# Altium schematic sheet DS18B20_继电器.SchDoc
size A4; PageSetup: Record=PageOptions|CenterHorizontal=True|CenterVertical=True|PrintScale=0.97|XCorrection=1.00|YCorrection=1.00|PrintKind=0|BorderSize=5000000|LeftOffset=0|BottomOffset=0|Orientation=2|PaperLength=1000|PaperWidth=1000|Scale=100|PaperSource=7|PrintQuality=-4|MediaType=1|DitherType=10|PaperKind=A4|PrintScaleMode=1
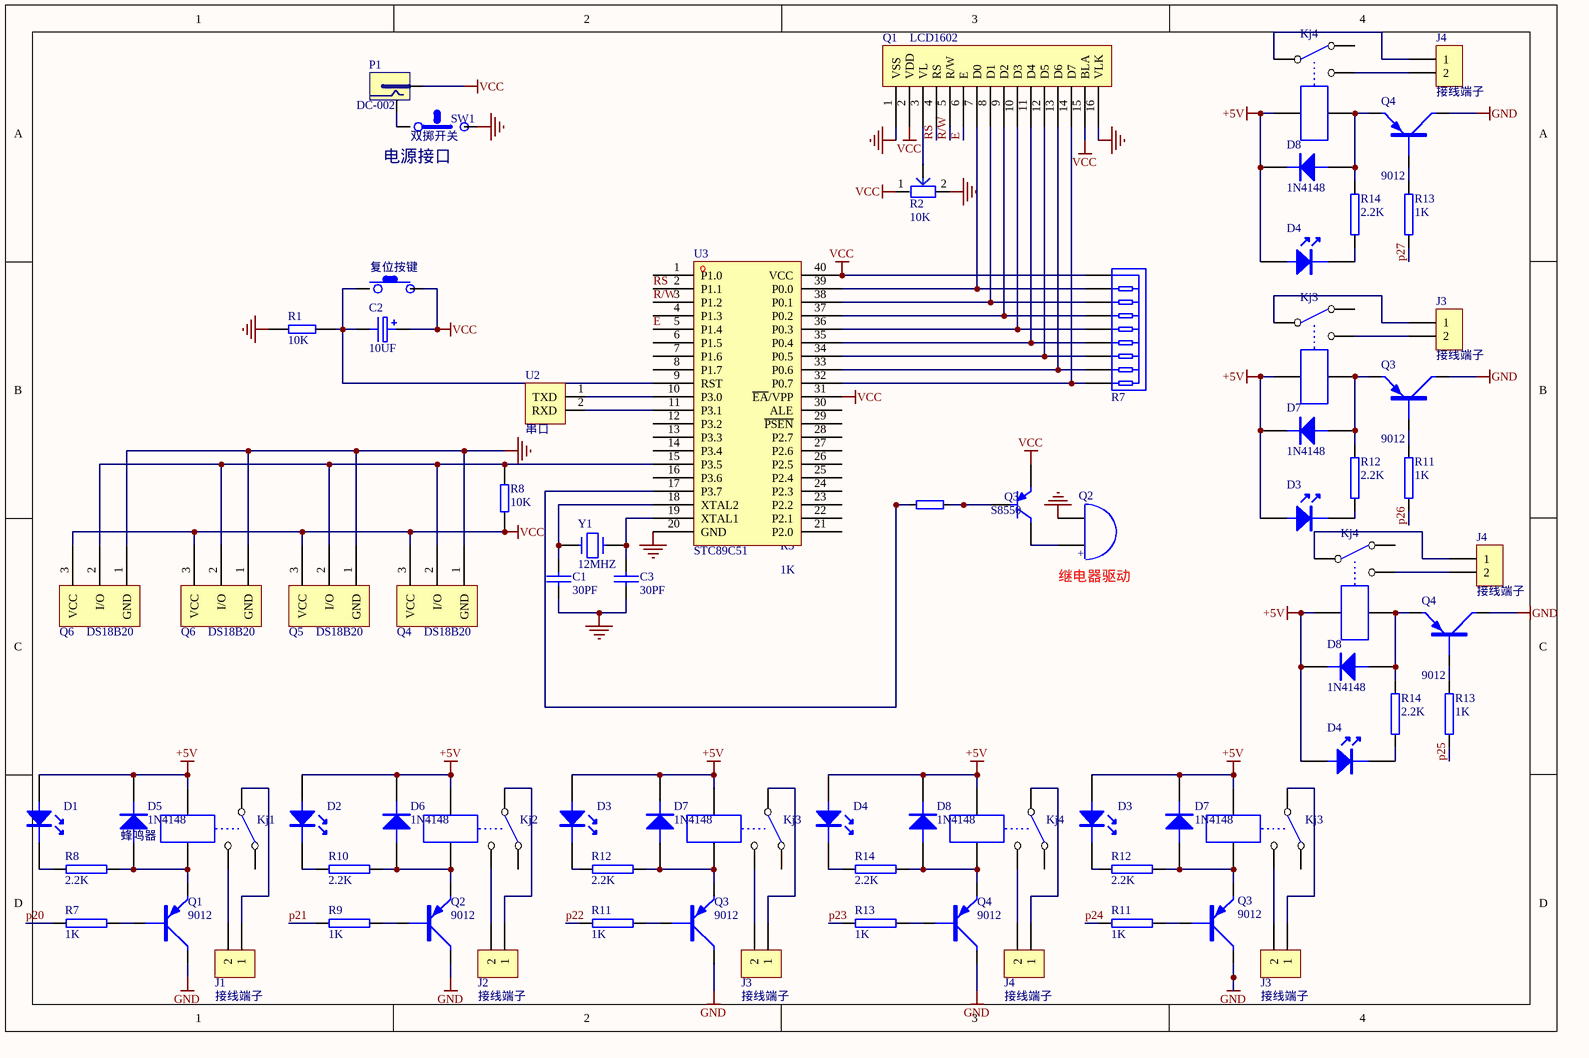
[diagram p0: DS18B20_继电器.SchDoc]

## Parts
(Parts that share a designator on the sheet are numbered #1, #2 ... from top to bottom, then left to right.)
C1  30PF  [R38]
C2  10UF  [CD4]
C3  30PF  [R38]
D1  (no value)  [LED5]
D2  (no value)  [LED5]
D3#1  (no value)  [LED5]
D3#2  (no value)  [LED5]
D3#3  (no value)  [LED5]
D4#1  (no value)  [LED5]
D4#2  (no value)  [LED5]
D4#3  (no value)  [LED5]
D5  1N4148  [4148]
D6  1N4148  [4148]
D7#1  1N4148  [4148]
D7#2  1N4148  [4148]
D7#3  1N4148  [4148]
D8#1  1N4148  [4148]
D8#2  1N4148  [4148]
D8#3  1N4148  [4148]
J1  接线端子
J2  接线端子
J3#1  接线端子
J3#2  接线端子
J3#3  接线端子
J4#1  接线端子
J4#2  接线端子
J4#3  接线端子
KEY1  复位按键  [SW]
Kj1  (no value)  [21F]
Kj2  (no value)  [21F]
Kj3#1  (no value)  [21F]
Kj3#2  (no value)  [21F]
Kj3#3  (no value)  [21F]
Kj4#1  (no value)  [21F]
Kj4#2  (no value)  [21F]
Kj4#3  (no value)  [21F]
P1  DC-002  [DC-002]
Q1#1  LCD1602  [HDR16]
Q1#2  9012  [9014]
Q2#1  蜂鸣器  [蜂鸣器]
Q2#2  9012  [9014]
Q3#1  9012  [9014]
Q3#2  S8550  [三极管]
Q3#3  9012  [9014]
Q3#4  9012  [9014]
Q4#1  9012  [9014]
Q4#2  DS18B20  [HDR3]
Q4#3  9012  [9014]
Q4#4  9012  [9014]
Q5  DS18B20  [HDR3]
Q6#1  DS18B20  [HDR3]
Q6#2  DS18B20  [HDR3]
R1  10K  [AXIAL-0.3]
R2  10K  [Res-JT]
R3  1K  [AXIAL-0.3]
R7#1  10k  [R*9]  (value not drawn)
R7#2  1K  [1/4W]
R8#1  10K  [AXIAL-0.3]
R8#2  2.2K  [1/4W]
R9  1K  [1/4W]
R10  2.2K  [1/4W]
R11#1  1K  [1/4W]
R11#2  1K  [1/4W]
R11#3  1K  [1/4W]
R12#1  2.2K  [1/4W]
R12#2  2.2K  [1/4W]
R12#3  2.2K  [1/4W]
R13#1  1K  [1/4W]
R13#2  1K  [1/4W]
R13#3  1K  [1/4W]
R14#1  2.2K  [1/4W]
R14#2  2.2K  [1/4W]
R14#3  2.2K  [1/4W]
SW1  双掷开关  [双掷开关]
U2  串口  [HDR2]
U3  STC89C51  [STC89C52]
Y1  12MHZ  [XTAL]

## Nets
+5V: D1.A D2.A D3#1.A D3#2.A D3#3.A D4#1.A D4#2.A D4#3.A D5.2(K) D6.2(K) D7#1.2(K) D7#2.2(K) D7#3.2(K) D8#1.2(K) D8#2.2(K) D8#3.2(K) Kj1.4 Kj2.4 Kj3#1.4 Kj3#2.4 Kj3#3.4 Kj4#1.4 Kj4#2.4 Kj4#3.4
GND: C1.2 C3.1 Q1#1.1(VSS) Q1#1.16(VLK) Q1#2.3(C) Q2#1.2 Q2#2.3(C) Q3#1.3(C) Q3#3.3(C) Q3#4.3(C) Q4#1.3(C) Q4#2.1(GND) Q4#3.3(C) Q4#4.3(C) Q5.1(GND) Q6#1.1(GND) Q6#2.1(GND) R1.1 R2.2 SW1.2 U3.20(GND)
VCC: C2.1 KEY1.2 P1.1 Q1#1.2(VDD) Q1#1.15(BLA) Q3#2.1(E) Q4#2.3(VCC) Q5.3(VCC) Q6#1.3(VCC) Q6#2.3(VCC) R2.1 R7#1.1 R8#1.2 U3.31(~{EA}/VPP) U3.40(VCC)
E: Q1#1.6(E) U3.5(P1.4)
p20: R7#2.1
p21: R9.1
p22: R11#2.1
p23: R13#3.1
p24: R11#3.1
p25: R13#2.1
p26: R11#1.1
p27: R13#1.1
R/W: Q1#1.5(R/W) U3.3(P1.2)
RS: Q1#1.4(RS) U3.2(P1.1)
NetC1_1: C1.1 U3.18(XTAL2) Y1.2
NetC2_2: C2.2(E) KEY1.1 R1.2 U3.9(RST)
NetC3_2: C3.2 U3.19(XTAL1) Y1.1
NetD1_K: D1.K R8#2.1
NetD2_K: D2.K R10.1
NetD3#1_K: D3#1.K R12#1.1
NetD3#2_K: D3#2.K R12#2.1
NetD3#3_K: D3#3.K R12#3.1
NetD4#1_K: D4#1.K R14#1.1
NetD4#2_K: D4#2.K R14#2.1
NetD4#3_K: D4#3.K R14#3.1
NetD5_1: D5.1(A) Kj1.5 Q1#2.2(E) R8#2.2
NetD6_1: D6.1(A) Kj2.5 Q2#2.2(E) R10.2
NetD7#1_1: D7#1.1(A) Kj3#1.5 Q3#1.2(E) R12#1.2
NetD7#2_1: D7#2.1(A) Kj3#2.5 Q3#3.2(E) R12#2.2
NetD7#3_1: D7#3.1(A) Kj3#3.5 Q3#4.2(E) R12#3.2
NetD8#1_1: D8#1.1(A) Kj4#1.5 Q4#1.2(E) R14#1.2
NetD8#2_1: D8#2.1(A) Kj4#2.5 Q4#3.2(E) R14#2.2
NetD8#3_1: D8#3.1(A) Kj4#3.5 Q4#4.2(E) R14#3.2
NetJ1_1: J1.1 Kj1.1
NetJ1_2: J1.2 Kj1.3
NetJ2_1: J2.1 Kj2.1
NetJ2_2: J2.2 Kj2.3
NetJ3#1_1: J3#1.1 Kj3#1.1
NetJ3#1_2: J3#1.2 Kj3#1.3
NetJ3#2_1: J3#2.1 Kj3#2.1
NetJ3#2_2: J3#2.2 Kj3#2.3
NetJ3#3_1: J3#3.1 Kj3#3.1
NetJ3#3_2: J3#3.2 Kj3#3.3
NetJ4#1_1: J4#1.1 Kj4#1.1
NetJ4#1_2: J4#1.2 Kj4#1.3
NetJ4#2_1: J4#2.1 Kj4#2.1
NetJ4#2_2: J4#2.2 Kj4#2.3
NetJ4#3_1: J4#3.1 Kj4#3.1
NetJ4#3_2: J4#3.2 Kj4#3.3
NetP1_2: P1.2 SW1.1
NetQ1#1_3: Q1#1.3(VL) R2.3
NetQ1#1_7: Q1#1.7(D0) R7#1.2 U3.39(P0.0)
NetQ1#1_8: Q1#1.8(D1) R7#1.3 U3.38(P0.1)
NetQ1#1_9: Q1#1.9(D2) R7#1.4 U3.37(P0.2)
NetQ1#1_10: Q1#1.10(D3) R7#1.5 U3.36(P0.3)
NetQ1#1_11: Q1#1.11(D4) R7#1.6 U3.35(P0.4)
NetQ1#1_12: Q1#1.12(D5) R7#1.7 U3.34(P0.5)
NetQ1#1_13: Q1#1.13(D6) R7#1.8 U3.33(P0.6)
NetQ1#1_14: Q1#1.14(D7) R7#1.9 U3.32(P0.7)
NetQ1#2_1: Q1#2.1(B) R7#2.2
NetQ2#1_1: Q2#1.1 Q3#2.3(C)
NetQ2#2_1: Q2#2.1(B) R9.2
NetQ3#1_1: Q3#1.1(B) R11#1.2
NetQ3#2_2: Q3#2.2(B) R3.2
NetQ3#3_1: Q3#3.1(B) R11#2.2
NetQ3#4_1: Q3#4.1(B) R11#3.2
NetQ4#1_1: Q4#1.1(B) R13#1.2
NetQ4#2_2: Q4#2.2(I/O) Q5.2(I/O) Q6#1.2(I/O) Q6#2.2(I/O) R8#1.1 U3.15(P3.5)
NetQ4#3_1: Q4#3.1(B) R13#2.2
NetQ4#4_1: Q4#4.1(B) R13#3.2
NetR3_1: R3.1 U3.17(P3.7)
NetU2_1: U2.1(TXD) U3.10(P3.0)
NetU2_2: U2.2(RXD) U3.11(P3.1)

Not connected (* = marked no-connect by the designer): Kj1 2; Kj2 2; Kj3#1 2; Kj3#2 2; Kj3#3 2; Kj4#1 2; Kj4#2 2; Kj4#3 2; U3 1(P1.0) 4(P1.3) 6(P1.5) 7(P1.6) 8(P1.7) 12(P3.2) 13(P3.3) 14(P3.4) 16(P3.6) 21(P2.0) 22(P2.1) 23(P2.2) 24(P2.3) 25(P2.4) 26(P2.5) 27(P2.6) 28(P2.7) 29(~{PSEN}) 30(ALE)

## Notes on the sheet
- (near SW1) 电源接口
- (near Q2#1) 继电器驱动
- (in symbol 蜂鸣器) +

## Library data of the parts
C1 C3 = 瓷片电容
C2 = 电解电容
D1 D2 D3#1-D3#3 D4#1-D4#3 = LED
D5 D6 D7#1-D7#3 D8#1-D8#3 = DIODE
J1 J2 J3#1-J3#3 J4#1-J4#3 = CON2: Connector
KEY1 = 微动开关
Kj1 Kj2 Kj3#1-Kj3#3 Kj4#1-Kj4#3 = RELAY-SPDT
Q1#2 Q2#2 Q3#1 Q3#3 Q3#4 Q4#1 Q4#3 Q4#4 = PNP2: PNP Transistor
R1 R3 R8#1 = RES
R2 = 电位器
R7#1 = 排阻
R7#2 R8#2 R9 R10 R11#1-R11#3 R12#1-R12#3 R13#1-R13#3 R14#1-R14#3 = RES2
U2 = 下载口
U3 = STC89C52
Y1 = XTAL